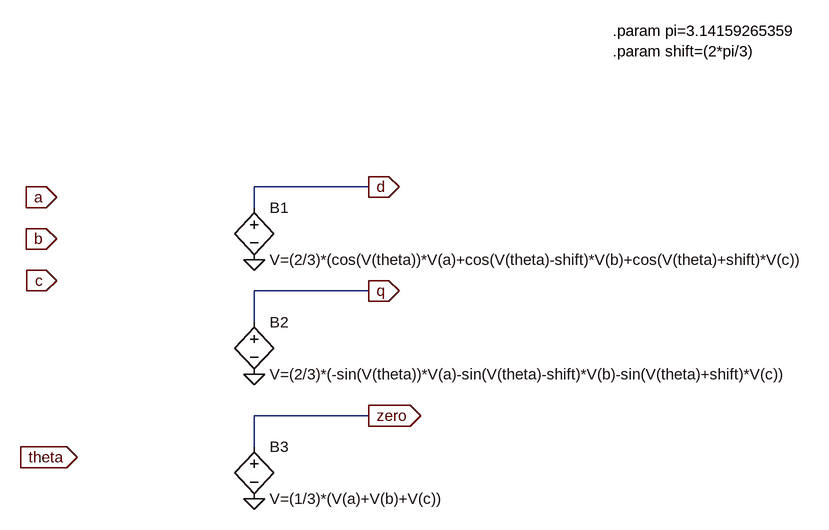
[diagram p0: schematic park.asc]
park.asc, the LTspice schematic file:
Version 4
SHEET 1 1212 680
WIRE 400 32 224 32
WIRE 224 64 224 32
WIRE 400 192 224 192
WIRE 224 240 224 192
WIRE 400 384 224 384
WIRE 224 432 224 384
FLAG -80 48 a
IOPIN -80 48 In
FLAG -80 112 b
IOPIN -80 112 In
FLAG -80 176 c
IOPIN -80 176 In
FLAG 224 144 0
FLAG 224 320 0
FLAG 400 32 d
IOPIN 400 32 Out
FLAG 400 192 q
IOPIN 400 192 Out
FLAG 224 512 0
FLAG 400 384 zero
IOPIN 400 384 Out
FLAG -48 448 theta
IOPIN -48 448 In
SYMBOL bv 224 48 R0
SYMATTR InstName B1
SYMATTR Value V=(2/3)*(cos(V(theta))*V(a)+cos(V(theta)-shift)*V(b)+cos(V(theta)+shift)*V(c))
SYMBOL bv 224 224 R0
SYMATTR InstName B2
SYMATTR Value V=(2/3)*(-sin(V(theta))*V(a)-sin(V(theta)-shift)*V(b)-sin(V(theta)+shift)*V(c))
SYMBOL bv 224 416 R0
SYMATTR InstName B3
SYMATTR Value V=(1/3)*(V(a)+V(b)+V(c))
TEXT 776 -208 Left 2 !.param pi=3.14159265359\n.param shift=(2*pi/3)

The netlist it stands for:
* park.asc
B1 d 0 V=(2/3)*(cos(V(theta))*V(a)+cos(V(theta)-shift)*V(b)+cos(V(theta)+shift)*V(c))
B2 q 0 V=(2/3)*(-sin(V(theta))*V(a)-sin(V(theta)-shift)*V(b)-sin(V(theta)+shift)*V(c))
B3 zero 0 V=(1/3)*(V(a)+V(b)+V(c))
.param pi=3.14159265359
.param shift=(2*pi/3)
.backanno
.end